# EasyEDA schematic 10.1_2021-05-31.json
TITLE: Project PCB Design; REV: 1.0; Date: 2021-05-31; Sheet: 1/1; Company: Deakin University
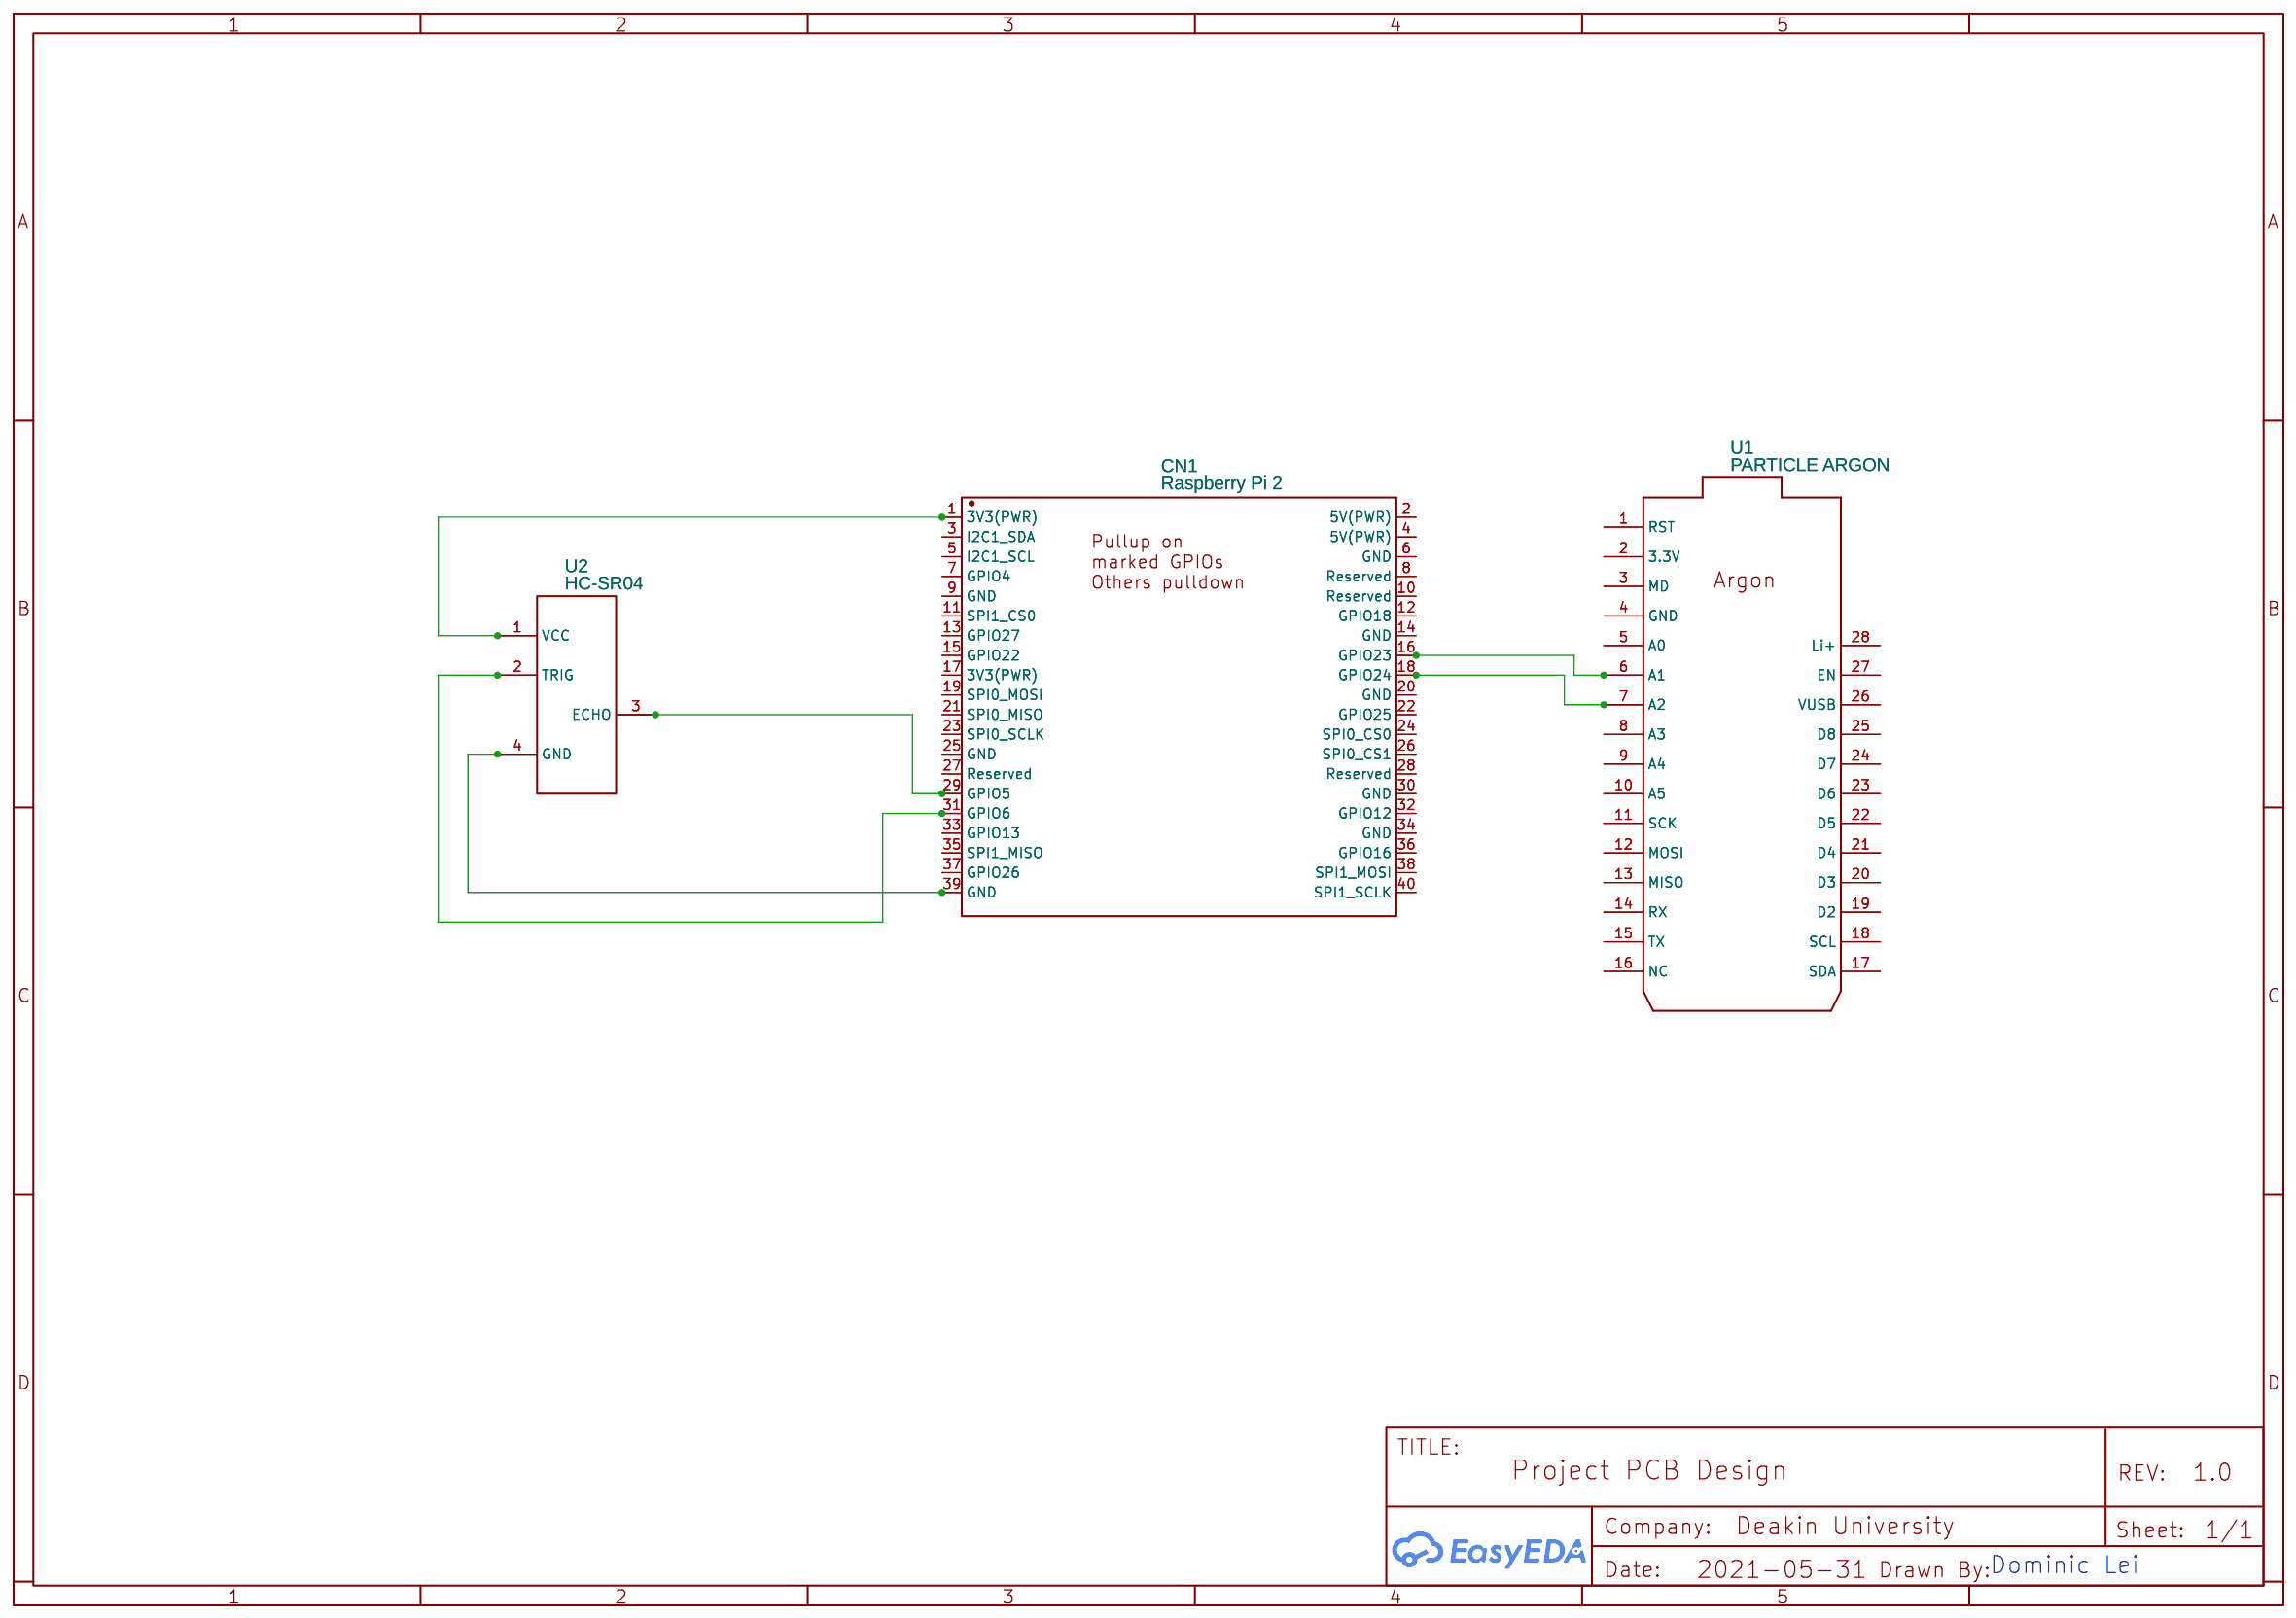
[diagram p0: schematic sheet]

## Parts
CN1  Raspberry Pi 2  [HDR2X20-REVERSED]
U1  PARTICLE ARGON  [PARTICLE ARGON]
U2  HC-SR04

## Library data of the parts
CN1 = Raspberry Pi 2: Contributor: Jason+Pierce; sourceId: gQK2WevN5
U1 = PARTICLE ARGON: Manufacturer: Particle; Manufacturer Part: Particle Argon; Supplier Part: Particle Argon; Supplier: Particle; Contributor: stevecoster
U2 = HC-SR04: Contributor: Adrian W

## Nets
Net-(CN1-1): CN1.1(3V3(PWR)) U2.1(VCC)
Net-(CN1-16): CN1.16(GPIO23) U1.6(A1)
Net-(CN1-18): CN1.18(GPIO24) U1.7(A2)
Net-(CN1-29): CN1.29(GPIO5) U2.3(ECHO)
Net-(CN1-31): CN1.31(GPIO6) U2.2(TRIG)
Net-(CN1-39): CN1.39(GND) U2.4(GND)

Not connected (* = marked no-connect by the designer): CN1 2(5V(PWR)) 3(I2C1 SDA) 4(5V(PWR)) 5(I2C1 SCL) 6(GND) 7(GPIO4) 8(Reserved) 9(GND) 10(Reserved) 11(SPI1 CS0) 12(GPIO18) 13(GPIO27) 14(GND) 15(GPIO22) 17(3V3(PWR)) 19(SPI0 MOSI) 20(GND) 21(SPI0 MISO) 22(GPIO25) 23(SPI0 SCLK) 24(SPI0 CS0) 25(GND) 26(SPI0 CS1) 27(Reserved) 28(Reserved) 30(GND) 32(GPIO12) 33(GPIO13) 34(GND) 35(SPI1 MISO) 36(GPIO16) 37(GPIO26) 38(SPI1 MOSI) 40(SPI1 SCLK); U1 1(RST) 2(3.3V) 3(MD) 4(GND) 5(A0) 8(A3) 9(A4) 10(A5) 11(SCK) 12(MOSI) 13(MISO) 14(RX) 15(TX) 16(NC) 17(SDA) 18(SCL) 19(D2) 20(D3) 21(D4) 22(D5) 23(D6) 24(D7) 25(D8) 26(VUSB) 27(EN) 28(Li+)

## Notes on the sheet
- Dominic Lei
